# Altium schematic sheet 48V to BOB.SchDoc: Power and Control
size 420 x 297 mm; ProjectTitle: 48V Driver; PageSetup: Record=PageOptions|CenterHorizontal=True|CenterVertical=True|PrintScale=1.00|XCorrection=1.00|YCorrection=1.00|PrintKind=1|BorderSize=5000000|LeftOffset=0|BottomOffset=0|Orientation=2|PaperLength=1000|PaperWidth=1000|Scale=100|PaperSource=7|PrintQuality=-4|MediaType=1|DitherType=10|PaperKind=A3|PrintScaleMode=1; EngineerDate: 26.12.21; DrawnByDate: 26.12.21; Author: R.Lerch; CompanyName: Enabling Innovation Trachsel; DrawnBy: R.Lerch; Engineer: R.Lerch; Address1: Kleinfeldstrasse 20; Address2: 2563 Ipsach; Address3: Switzerland; SheetNumber: 1; SheetTotal: 1
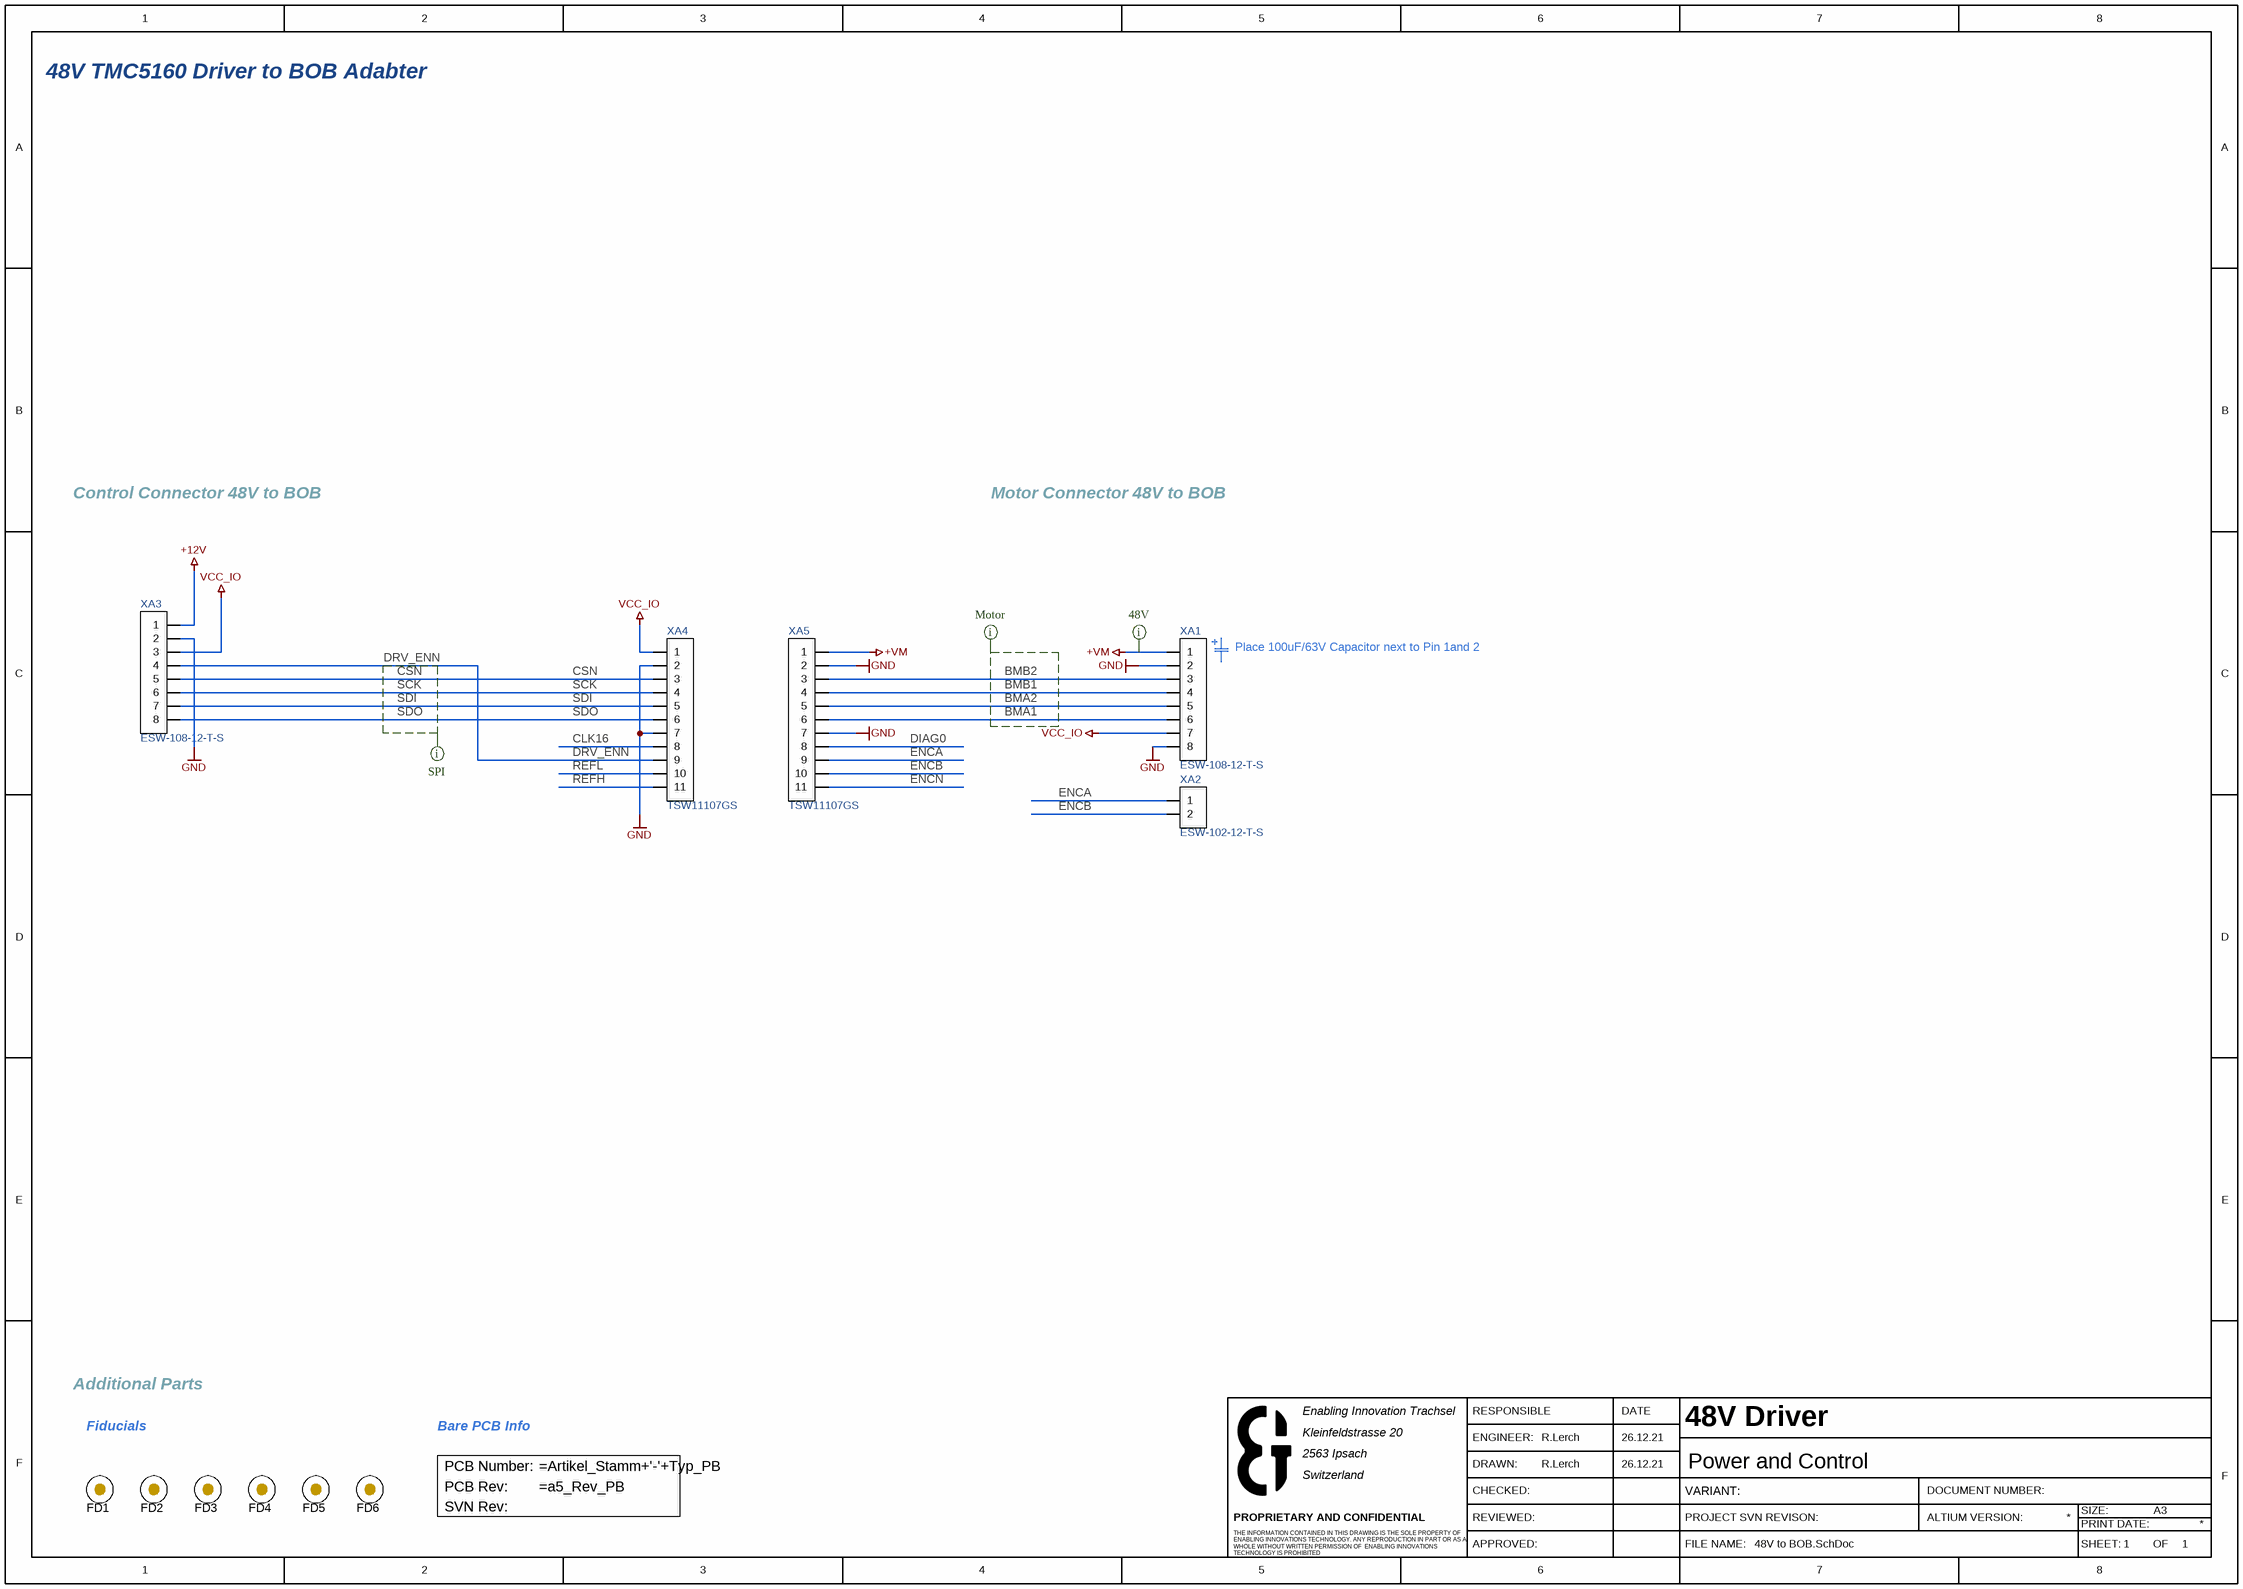
[diagram p0: 48V to BOB.SchDoc]

## Parts
=Artikel_Stamm+'-'+Typ_PB  Printed Circuit Board  (value not drawn)  (mechanical)
FD1  Fiducial Mark  [Fiducial]  (value not drawn)  (no BOM)
FD2  Fiducial Mark  [Fiducial]  (value not drawn)  (no BOM)
FD3  Fiducial Mark  [Fiducial]  (value not drawn)  (no BOM)
FD4  Fiducial Mark  [Fiducial]  (value not drawn)  (no BOM)
FD5  Fiducial Mark  [Fiducial]  (value not drawn)  (no BOM)
FD6  Fiducial Mark  [Fiducial]  (value not drawn)  (no BOM)
XA1  ESW-108-12-T-S  [SAMTEC_ESW-108-12-T-S]
XA2  ESW-102-12-T-S  [SAMTEC_ESW-102-12-G-S]
XA3  ESW-108-12-T-S  [SAMTEC_ESW-108-12-T-S]
XA4  TSW11107GS  [SAMTEC_TSW-111-07-G-S]
XA5  TSW11107GS  [SAMTEC_TSW-111-07-G-S]

## Nets
+12V: XA3.1
+VM: XA1.1 XA5.1
GND: XA1.2 XA1.8 XA3.2 XA4.2 XA4.7 XA5.2 XA5.7
VCC_IO: XA1.7 XA3.3 XA4.1
BMA1: XA1.6 XA5.6
BMA2: XA1.5 XA5.5
BMB1: XA1.4 XA5.4
BMB2: XA1.3 XA5.3
CLK16: XA4.8
CSN: XA3.5 XA4.3
DIAG0: XA5.8
DRV_ENN: XA3.4 XA4.9
ENCA: XA2.1 XA5.9
ENCB: XA2.2 XA5.10
ENCN: XA5.11
REFH: XA4.11
REFL: XA4.10
SCK: XA3.6 XA4.4
SDI: XA3.7 XA4.5
SDO: XA3.8 XA4.6

## Layout directives
net class Motor: BMA1, BMA2, BMB1, BMB2
net class SPI: CSN, DRV_ENN, SCK, SDI, SDO
net class 48V: +VM

## Notes on the sheet
- 48V TMC5160 Driver to BOB Adabter
- Control Connector 48V to BOB
- Motor Connector 48V to BOB
- Place 100uF/63V Capacitor next to Pin 1and 2
- Additional Parts
- Fiducials
- (near =Artikel_Stamm+'-'+Typ_PB) Bare PCB Info
- 1
- 2
- 3
- 4
- 5
- 6
- 7
- 8
- A
- B
- C
- D
- E
- RESPONSIBLE
- DATE
- F
- ENGINEER:
- DRAWN:
- PROPRIETARY AND CONFIDENTIAL
- REVIEWED:
- CHECKED:
- APPROVED:
- FILE NAME:
- VARIANT:
- PROJECT SVN REVISON:
- DOCUMENT NUMBER:
- ALTIUM VERSION:
- SIZE:
- SHEET:
- PRINT DATE:
- OF
- A3
- THE INFORMATION CONTAINED IN THIS DRAWING IS THE SOLE PROPERTY OF ENABLING INNOVATIONS TECHNOLOGY. ANY REPRODUCTION IN PART OR AS A WHOLE WITHOUT WRITTEN PERMISSION OF  ENABLING INNOVATIONS TECHNOLOGY IS PROHIBITED
- (in symbol Bare PCB) PCB Number:; PCB Rev:; SVN Rev:

## Library data of the parts
=Artikel_Stamm+'-'+Typ_PB = Bare PCB: Manufacturer: Any; CompType: PCB; PartNumber: =Artikel_Stamm+'-'+Typ_PB; MountType: N/A; Key: PCB; PartValue: =Artikel_Stamm+'-'+Typ_PB
FD1-FD6 = CMP-013-00002-0: Fiducial mark.  There is nothing to buy or mount.; Manufacturer: N/A; MountType: N/A; PackageReference: Fiducial; PartNumber: N/A; ClassName: FiducialMark; PartValue: Fiducial Mark
XA1 XA3 = CMP-008-00005-0: Con Socket PCB SMD 8Pos 2.54mm; Part Number: 13-0359; Part Description: 8 Pin PCB Socket Strips, 2.54mm (0.100") pitch; Manufacturer 1: Samtec; Manufacturer Part Number 1: TSW-108-07-G-S; LatestRevision Note: Initial; Voltage: 250V; Current: 3A; AECQ: False; Order Number: 200-ESW10812TS; System: Connector; Type1: CON; Type2: 2.54mm; PartValue: ESW-108-12-T-S; ROHS: True; ComponentLink1Description: Datasheet; ComponentLink1URL: https://suddendocs.samtec.com/catalog_english/esw_th.pdf; Author: Lerch; Distributor: Mouser
XA2 = CMP-008-00004-0: Con Socket PCB SMD 2Pos 2.54mm; Part Description: 2 Pin, PCB Socket Strips, 2.54mm (0.100") pitch; Manufacturer 1: Samtec; LatestRevision Note: Initial; Voltage: 250V; Current: 3A; AECQ: False; Order Number: 200-ESW10212TS; System: Connector; Type1: CON; Type2: 2.54mm; PartValue: ESW-102-12-T-S; ROHS: True; ComponentLink1Description: Datasheet; ComponentLink1URL: https://suddendocs.samtec.com/catalog_english/esw_th.pdf; Author: Lerch; Manufacturer Part Number 1: ESW-102-12-T-S; Distributor: Mouser
XA4 XA5 = CMP-008-00003-0: Con Header PCB SMD 11Pos 2.54mm; Part Description: 11 Pin PCB Header Strips, 2.54mm (0.100") pitch; Manufacturer 1: Samtec; Manufacturer Part Number 1: TSW-111-07-G-S; LatestRevision Note: Initial; Voltage: 250V; Current: 3A; AECQ: False; Order Number: 200-TSW11107GS; System: Connector; Type1: CON; Type2: 2.54mm; PartValue: TSW11107GS; ROHS: True; ComponentLink1Description: Datasheet; ComponentLink1URL: https://suddendocs.samtec.com/catalog_english/tsw_th.pdf; Author: Lerch; Distributor: Mouser